# Altium schematic sheet DELPHI.SchDoc
size B; SheetNumber: 1; SheetTotal: 1
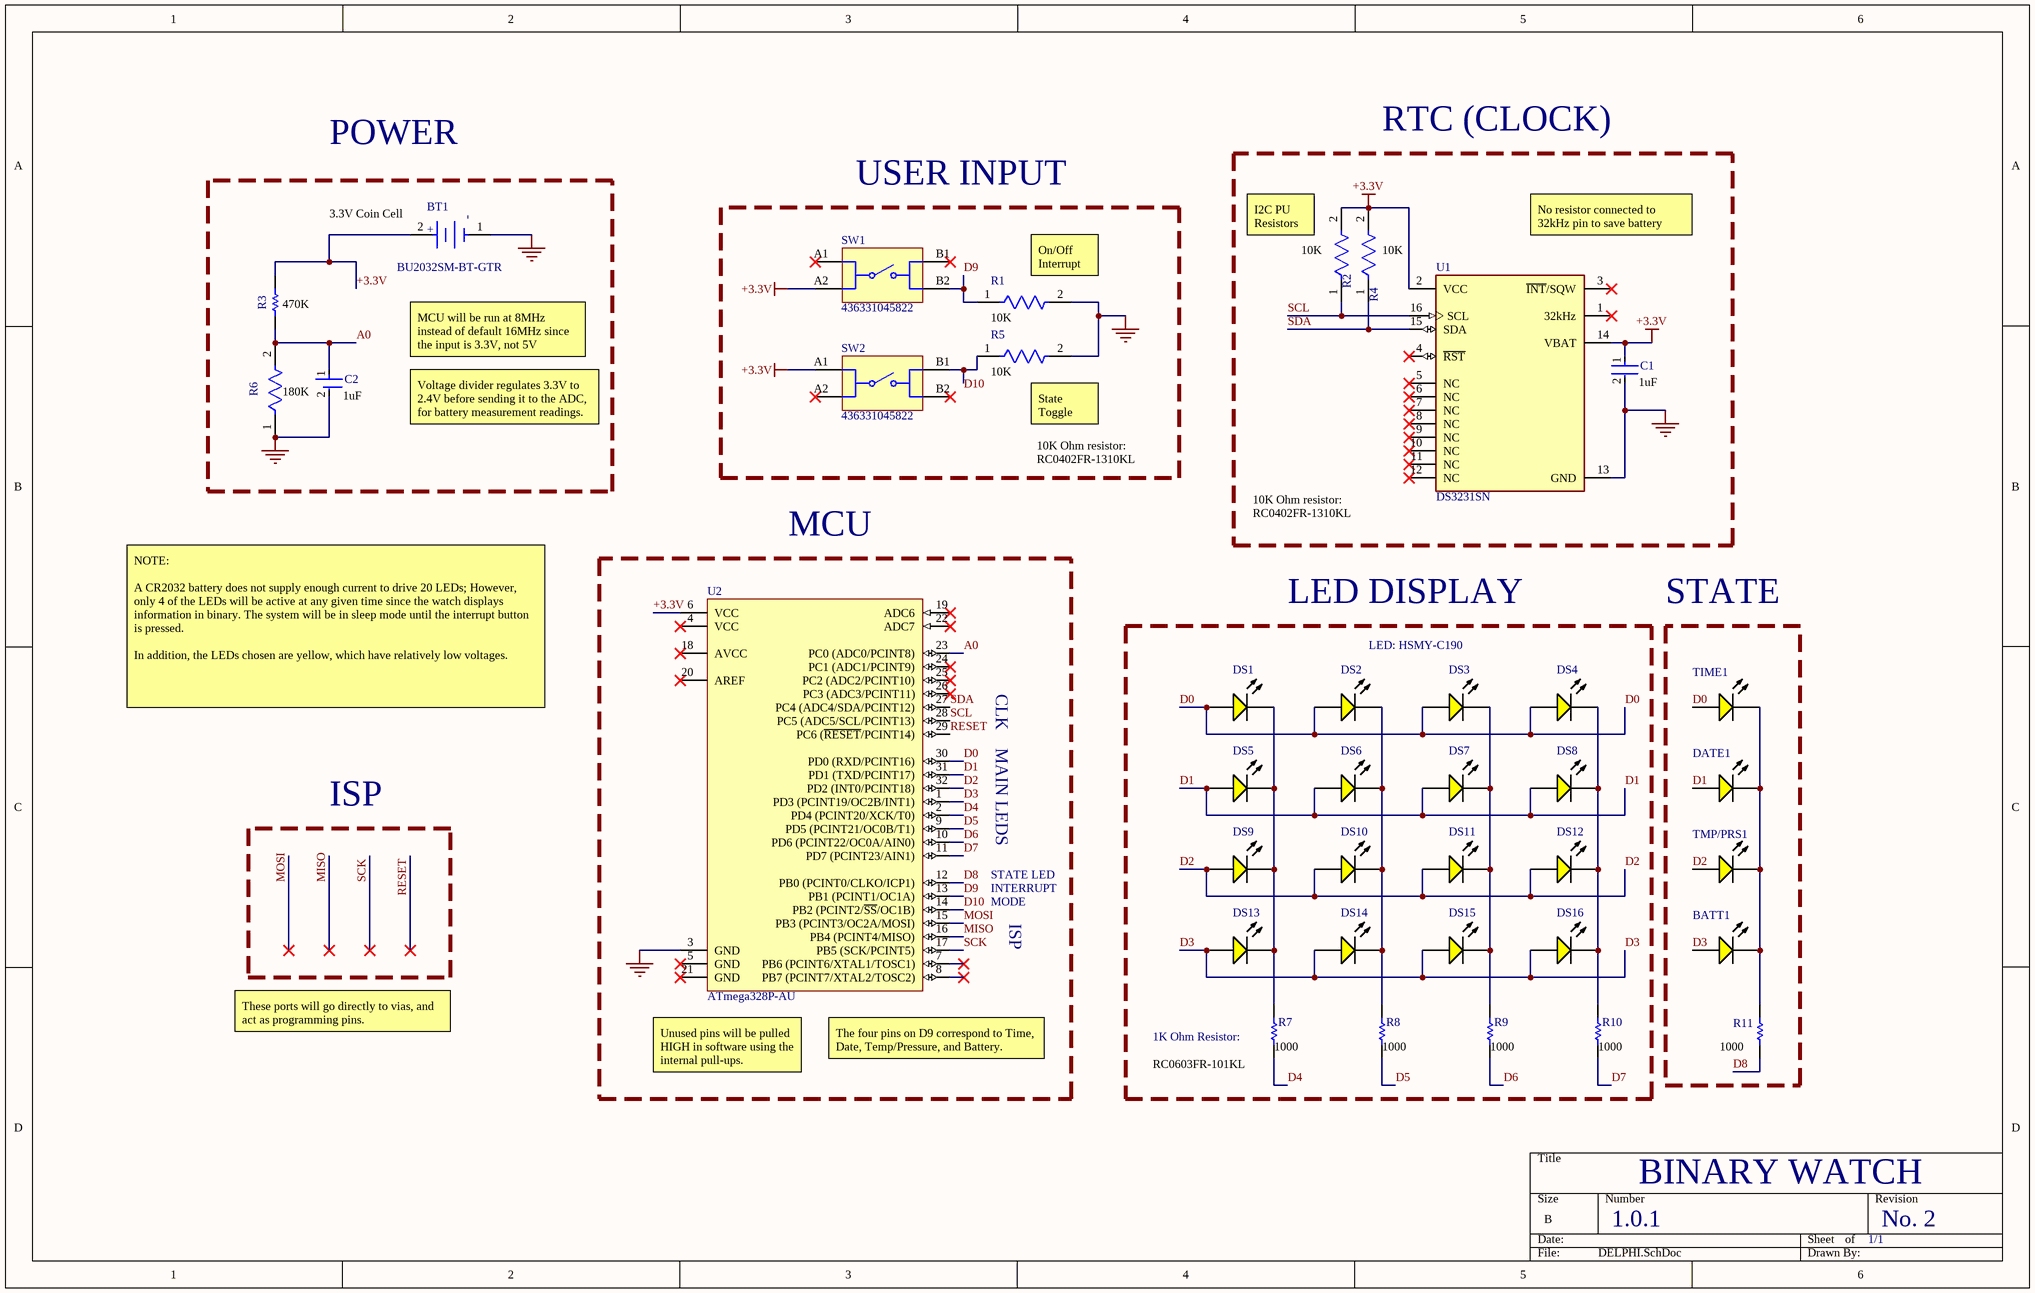
[diagram p0: DELPHI.SchDoc]

## Parts
BATT1  HSMY-C190  [AVAG-HSMX-C190_V]  (value not drawn)
BT1  BU2032SM-BT-GTR  [FP-BU2032SM-BT-GTR-MFG]
C1  GRM155R61H105KE05D  [FP-GRM155-0_1-MFG]  (value not drawn)
C2  GRM155R61H105KE05D  [FP-GRM155-0_1-MFG]  (value not drawn)
DATE1  HSMY-C190  [AVAG-HSMX-C190_V]  (value not drawn)
DS1  HSMY-C190  [AVAG-HSMX-C190_V]  (value not drawn)
DS2  HSMY-C190  [AVAG-HSMX-C190_V]  (value not drawn)
DS3  HSMY-C190  [AVAG-HSMX-C190_V]  (value not drawn)
DS4  HSMY-C190  [AVAG-HSMX-C190_V]  (value not drawn)
DS5  HSMY-C190  [AVAG-HSMX-C190_V]  (value not drawn)
DS6  HSMY-C190  [AVAG-HSMX-C190_V]  (value not drawn)
DS7  HSMY-C190  [AVAG-HSMX-C190_V]  (value not drawn)
DS8  HSMY-C190  [AVAG-HSMX-C190_V]  (value not drawn)
DS9  HSMY-C190  [AVAG-HSMX-C190_V]  (value not drawn)
DS10  HSMY-C190  [AVAG-HSMX-C190_V]  (value not drawn)
DS11  HSMY-C190  [AVAG-HSMX-C190_V]  (value not drawn)
DS12  HSMY-C190  [AVAG-HSMX-C190_V]  (value not drawn)
DS13  HSMY-C190  [AVAG-HSMX-C190_V]  (value not drawn)
DS14  HSMY-C190  [AVAG-HSMX-C190_V]  (value not drawn)
DS15  HSMY-C190  [AVAG-HSMX-C190_V]  (value not drawn)
DS16  HSMY-C190  [AVAG-HSMX-C190_V]  (value not drawn)
R1  RC0402FR-1310KL  [FP-RC0402-0_4-IPC_A]  (value not drawn)
R2  RC0402FR-1310KL  [FP-RC0402-0_4-IPC_A]  (value not drawn)
R3  (no value)  [RESC1005X40X25NL05T10]
R4  RC0402FR-1310KL  [FP-RC0402-0_4-IPC_A]  (value not drawn)
R5  RC0402FR-1310KL  [FP-RC0402-0_4-IPC_A]  (value not drawn)
R6  (no value)  [FP-CR0402-IPC_A]
R7  RC0603FR-101KL  [RESC1608X55X25LL10T15]  (value not drawn)
R8  RC0603FR-101KL  [RESC1608X55X25LL10T15]  (value not drawn)
R9  RC0603FR-101KL  [RESC1608X55X25LL10T15]  (value not drawn)
R10  RC0603FR-101KL  [RESC1608X55X25LL10T15]  (value not drawn)
R11  RC0603FR-101KL  [RESC1608X55X25LL10T15]  (value not drawn)
SW1  436331045822  [436331045822]
SW2  436331045822  [436331045822]
TIME1  HSMY-C190  [AVAG-HSMX-C190_V]  (value not drawn)
TMP/PRS1  HSMY-C190  [AVAG-HSMX-C190_V]  (value not drawn)
U1  DS3231SN  [FP-W16-H2-MFG]
U2  ATmega328P-AU  [32A_M]

## Blocks framed on the sheet
RTC (CLOCK): C1 R2 R4 U1
USER INPUT: R1 R5 SW1 SW2
MCU: U2
LED DISPLAY: DS1-DS16 R7-R10
STATE: BATT1 DATE1 R11 TIME1 TMP/PRS1

## Nets
+3.3V: BT1.2(A) C1.1 R2.2 R3.1 R4.2 SW1.A2 SW2.A1 U1.2(VCC) U1.14(VBAT) U2.6(VCC)
NetBT1_1: BT1.1(C) C1.2 C2.2 R1.2 R5.2 R6.1 U1.13(GND) U2.3(GND)
A0: C2.1 R3.2 R6.2 U2.23(PC0_(ADC0/PCINT8))
D0: DS1.1(A) DS2.1(A) DS3.1(A) DS4.1(A) TIME1.1(A) U2.30(PD0_(RXD/PCINT16))
D1: DATE1.1(A) DS5.1(A) DS6.1(A) DS7.1(A) DS8.1(A) U2.31(PD1_(TXD/PCINT17))
D2: DS9.1(A) DS10.1(A) DS11.1(A) DS12.1(A) TMP/PRS1.1(A) U2.32(PD2_(INT0/PCINT18))
D3: BATT1.1(A) DS13.1(A) DS14.1(A) DS15.1(A) DS16.1(A) U2.1(PD3_(PCINT19/OC2B/INT1))
D4: R7.1 U2.2(PD4_(PCINT20/XCK/T0))
D5: R8.1 U2.9(PD5_(PCINT21/OC0B/T1))
D6: R9.1 U2.10(PD6_(PCINT22/OC0A/AIN0))
D7: R10.1 U2.11(PD7_(PCINT23/AIN1))
D8: R11.1 U2.12(PB0_(PCINT0/CLKO/ICP1))
D9: R1.1 SW1.B2 U2.13(PB1_(PCINT1/OC1A))
D10: R5.1 SW2.B1 U2.14(PB2_(PCINT2/~{SS}/OC1B))
MISO: U2.16(PB4_(PCINT4/MISO))
MOSI: U2.15(PB3_(PCINT3/OC2A/MOSI))
RESET: U2.29(PC6_(~{RESET}/PCINT14))
SCK: U2.17(PB5_(SCK/PCINT5))
SCL: R2.1 U1.16(SCL) U2.28(PC5_(ADC5/SCL/PCINT13))
SDA: R4.1 U1.15(SDA) U2.27(PC4_(ADC4/SDA/PCINT12))
NetBATT1_2: BATT1.2(K) DATE1.2(K) R11.2 TIME1.2(K) TMP/PRS1.2(K)
NetDS1_2: DS1.2(K) DS5.2(K) DS9.2(K) DS13.2(K) R7.2
NetDS2_2: DS2.2(K) DS6.2(K) DS10.2(K) DS14.2(K) R8.2
NetDS3_2: DS3.2(K) DS7.2(K) DS11.2(K) DS15.2(K) R9.2
NetDS4_2: DS4.2(K) DS8.2(K) DS12.2(K) DS16.2(K) R10.2

Not connected (* = marked no-connect by the designer): SW1 A1* B1*; SW2 A2* B2*; U1 1(32kHz)* 3(~{INT}/SQW)* 4(~{RST})* 5(NC)* 6(NC)* 7(NC)* 8(NC)* 9(NC)* 10(NC)* 11(NC)* 12(NC)*; U2 4(VCC)* 5(GND)* 7(PB6_(PCINT6/XTAL1/TOSC1))* 8(PB7_(PCINT7/XTAL2/TOSC2))* 18(AVCC)* 19(ADC6)* 20(AREF)* 21(GND)* 22(ADC7)* 24(PC1_(ADC1/PCINT9))* 25(PC2_(ADC2/PCINT10))* 26(PC3_(ADC3/PCINT11))*

## Notes on the sheet
- POWER
- (near BT1) 3.3V Coin Cell
- (near R2) I2C PU Resistors
- No resistor connected to 32kHz pin to save battery
- (near R1) On/Off Interrupt
- (near R2) 10K
- (near R4) 10K
- (near R3) 470K
- MCU will be run at 8MHz instead of default 16MHz since the input is 3.3V, not 5V
- (near R1) 10K
- 180K
- (near C2) 1uF
- Voltage divider regulates 3.3V to 2.4V before sending it to the ADC, for battery measurement readings.
- (near R5) 10K
- (near R5) State Toggle
- (near C1) 1uF
- RC0402FR-1310KL
- 10K Ohm resistor:
- NOTE:
  A CR2032 battery does not supply enough current to drive 20 LEDs; However, only 4 of the LEDs will be active at any given time since the watch displays information in binary. The system will be in sleep mode until the interrupt button is pressed.
  In addition, the LEDs chosen are yellow, which have relatively low voltages.
- CLK
- LED: HSMY-C190
- MAIN LEDS
- ISP
- STATE LED
- INTERRUPT
- MODE
- These ports will go directly to vias, and act as programming pins.
- (near R7) 1K Ohm Resistor:
- (near U2) Unused pins will be pulled HIGH in software using the internal pull-ups.
- (near U2) The four pins on D9 correspond to Time, Date, Temp/Pressure, and Battery.
- (near R7) RC0603FR-101KL
- (near R7) 1000
- (near R8) 1000
- (near R9) 1000
- (near R10) 1000
- (near R11) 1000
- 1.0.1
- BINARY WATCH
- 1/1
- No. 2
- (in symbol CMP-136216-000002-1) -; +

## Library data of the parts
BATT1 DATE1 DS1-DS16 TIME1 TMP/PRS1 = CMP-1744-00003-1: LED Uni-Color Yellow, 65 mW, 20 mA, -40 to 85 degC, 2-Pin SMD, RoHS, Tape and Reel; Tolerance: 1%; Voltage Rating: 50 V; Power Rating: 100 mW; Case\Package: 0603; Resistance: 390 Ohm; Min Operating Temperature: -55 degC; Length: 1.6 mm; ComponentLink3Description: Package Specification; Mount: Surface Mount; PackageReference: HSMX-C190; ComponentLink2Description: Datasheet; DatasheetVersion: Mar-12; Case Code (Metric): 1608; Pins: 2; Package Quantity: 5000; ComponentLink2URL: http://docs.avagotech.com/docs/AV02-0551EN; ComponentLink1Description: Manufacturer URL; RoHSCompliant: true; Packaging: Tape and Reel; PackageDescription: 2-Pin Surface Mount Device, Body 1.6 x 0.8 mm, Height 0.9 mm; REACH SVHC: No SVHC; ComponentLink3URL: http://www.fairchildsemi.com/dwg/MA/MA03D.pdf; Voltage Rating (DC): 50 V; Width: 0.8 mm; ComponentLink1URL: http://www.avagotech.com/; Max Operating Temperature: 155 degC; Case Code (Imperial): 0603; Height: 0.45 mm
BT1 = CMP-136216-000002-1: BATTERY HOLDER COIN 20MM SMD; Number of Cells: 1; Termination: SMD/SMT; Mount: Surface Mount; Max Operating Temperature: 280°C; Min Operating Temperature: -40°C; Package Quantity: 400; Case/Package: SMD/SMT
C1 C2 = CMP-06035-026840-2: CERAMIC CAP, MLCC 1UF 50VDC X5R
R1 R2 R4 R5 = CMP-2002-07854-2: RESISTOR 0402 10K 1%; Power Rating: 62.5mW; Voltage Rating (DC): 50V; Resistance: 10kR; Temperature Coefficient: 100ppm/°C; REACH SVHC: No SVHC; Case/Package: 0402; Termination: SMD/SMT; Max Operating Temperature: 155°C; Contact Plating: Tin; Resistance Tolerance: 1%; Radiation Hardening: No; Voltage Rating: 50V; Lead Free: Lead Free; Length: 1mm; Depth: 0.5mm; Number of Pins: 2; RoHS Compliant: Yes; Case Code (Imperial): 0402; Case Code (Metric): 1005; Min Operating Temperature: -55°C; Packaging: Tape and Reel; Technology: THICK FILM; Series: RC; Number of Terminations: 2; Resistor Type: Thick Film; Tolerance: 1%; Working Voltage: 50V; Military Standard: Not; Construction: Rectangular
R3 = CMP-2002-07696-1: Part Number: RC0402FR-07470KL; Manufacturer: Yageo / Phycomp
R6 = CMP-2002-04875-2: Thick Film Chip Resistors 0402 180kΩ 0.0625W 1% 100ppm/°C; Power Rating: 62.5mW; Resistance: 180kR; Voltage Rating: 50V; Depth: 0.5mm; Tolerance: 1%; Width: 0.5mm; Package Quantity: 10000; Length: 1mm; Height: 0.35mm; Case/Package: 0402; Case Code (Metric): 1005; Thickness: 356um; Max Operating Temperature: 125°C; Termination: SMD/SMT; Packaging: Tape and Reel; Mount: Surface Mount; Military Standard: Not; Contact Plating: Tin; Case Code (Imperial): 0402; Temperature Coefficient: 100ppm/°C; Min Operating Temperature: -55°C; Radiation Hardening: No; Composition: Thick Film
R7-R11 = CMP-2000-04176-1: Manufacturer: Yageo; Part Number: RC0603FR-101KL
SW1 SW2 = CMP-1463-00001-3: NexarPartId: 22862795; Contact Current Rating: 50mA; Contact Resistance: 100mΩ; Voltage Rating: 12V; Life (Cycles): 100kcycles; Max Operating Temperature: 85°C; Mount: Surface Mount; Height: 1.65mm; RoHS: Compliant; Contact Plating: Silver; Min Operating Temperature: -40°C; Voltage Rating (DC): 12V; Current Rating: 50mA; Insulation Resistance: 100MΩ; Packaging: Tape and Reel; Width: 4.7mm
U1 = CMP-0254-00375-2: IC RTC CLK/CALENDAR I2C 16-SOIC; Operating Supply Voltage: 3.3V; Max Supply Voltage: 5.5V; Logic Function: Clock; Time Format: HH:MM:SS; Date Format: YY-MM-DD-dd; Min Supply Voltage: 2.3V; Min Operating Temperature: -40°C; Packaging: Tape and Reel; Radiation Hardening: No; Package Quantity: 1000; Case/Package: SOIC; Max Operating Temperature: 85°C; Lead Free: Lead Free; Interface: I2C; Contact Plating: Tin; Number of Pins: 16; Mount: Surface Mount
U2 = CMP-0095-00269-2: 8-bit AVR Microcontroller, 32KB Flash, 1KB EEPROM, 2KB SRAM, 32-pin TQFP, Industrial Grade (-40°C to 85°C); PackageDescription: 32-Lead, 7x7x1.0 mm Body, 0.8mm Lead Pitch, Thin Profile Plastic Quad Flat Package (TQFP); DatasheetVersion: revD, May-2011; RevisionNote: DatasheetVersion & PackageVersion updated. URLs added.; ComponentLink1URL: http://www.atmel.com/; ComponentLink2Description: ATmega48A/48PA/88A/88PA/168A/168PA/328/328P Datasheet; Code_JEDEC: MS-026-ABA; ComponentLink1Description: Manufacturer URL; PackageReference: 32A; ComponentLink3Description: ATmega48A/48PA/88A/88PA/168A/168PA/328/328P Summary; ComponentLink2URL: http://www.atmel.com/dyn/resources/prod_documents/doc8271.pdf; PackageVersion: revC, Oct-2010; ComponentLink3URL: http://www.atmel.com/dyn/resources/prod_documents/8271S.pdf